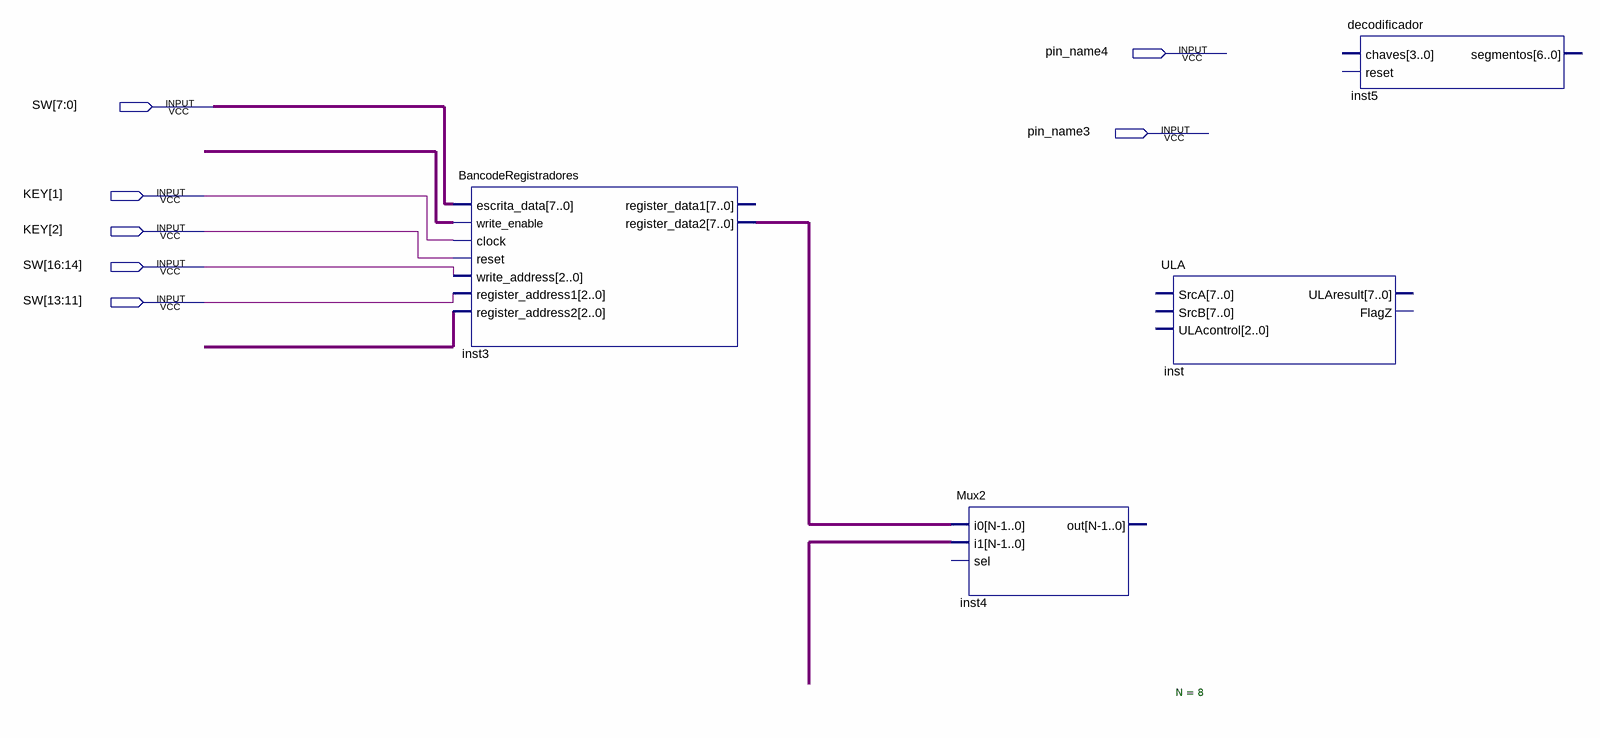
[diagram p0: schematic sheet]
// Quartus schematic muxas.bdf as structural Verilog: 4 symbols, 7 pins
module muxas (
  input  pin_name4,
  input  [16:0] SW,
  input  pin_name3,
  input  [2:1] KEY
);

  wire undriven_2;
  wire [2:0] undriven_3;
  wire [7:0] inst3_register_data2, undriven;

  BancodeRegistradores inst3 (
    .escrita_data(SW[7:0]), .write_enable(undriven_2), .clock(KEY[1]), .reset(KEY[2]),
    .write_address(SW[16:14]), .register_address1(SW[13:11]), .register_address2(undriven_3),
    .register_data2(inst3_register_data2));  // open: register_data1
  Mux2 #(.N(8)) inst4 (.i0(inst3_register_data2), .i1(undriven));  // open: sel, out
  ULA inst ();  // open: SrcA, SrcB, ULAcontrol, ULAresult, FlagZ
  decodificador inst5 ();  // open: chaves, reset, segmentos
endmodule
